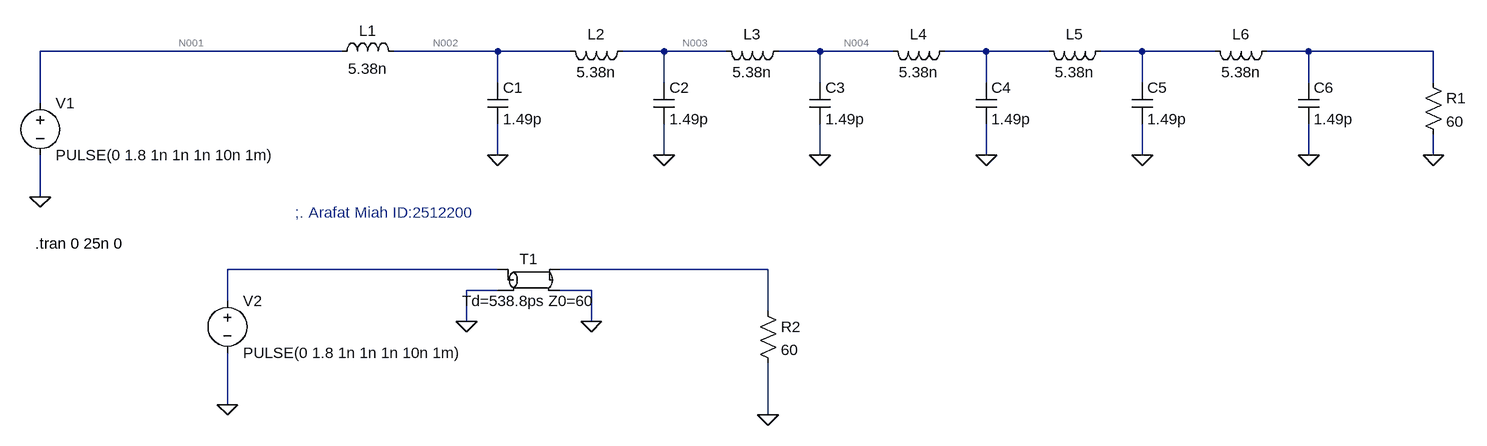
[diagram p0: schematic Draft1.asc]
Draft1.asc, the LTspice schematic file:
Version 4
SHEET 1 2136 680
WIRE 352 64 -112 64
WIRE 592 64 432 64
WIRE 704 64 592 64
WIRE 848 64 784 64
WIRE 944 64 848 64
WIRE 1088 64 1024 64
WIRE 1200 64 1088 64
WIRE 1344 64 1280 64
WIRE 1440 64 1344 64
WIRE 1584 64 1520 64
WIRE 1696 64 1584 64
WIRE 1840 64 1776 64
WIRE 2032 64 1840 64
WIRE 592 112 592 64
WIRE 848 112 848 64
WIRE 1088 112 1088 64
WIRE 1344 112 1344 64
WIRE 1584 112 1584 64
WIRE 1840 112 1840 64
WIRE 2032 112 2032 64
WIRE -112 144 -112 64
WIRE 592 224 592 176
WIRE 848 224 848 176
WIRE 1088 224 1088 176
WIRE 1344 224 1344 176
WIRE 1584 224 1584 176
WIRE 1840 224 1840 176
WIRE 2032 224 2032 192
WIRE -112 288 -112 224
WIRE 592 400 176 400
WIRE 1008 400 688 400
WIRE 592 432 544 432
WIRE 736 432 688 432
WIRE 176 448 176 400
WIRE 1008 464 1008 400
WIRE 544 480 544 432
WIRE 736 480 736 432
WIRE 176 608 176 528
WIRE 1008 624 1008 544
FLAG -112 288 0
FLAG 592 224 0
FLAG 848 224 0
FLAG 1088 224 0
FLAG 1344 224 0
FLAG 1584 224 0
FLAG 1840 224 0
FLAG 2032 224 0
FLAG 544 480 0
FLAG 736 480 0
FLAG 176 608 0
FLAG 1008 624 0
SYMBOL voltage -112 128 R0
WINDOW 123 0 0 Left 0
WINDOW 39 0 0 Left 0
SYMATTR InstName V1
SYMATTR Value PULSE(0 1.8 1n 1n 1n 10n 1m)
SYMBOL res 2016 96 R0
SYMATTR InstName R1
SYMATTR Value 60
SYMBOL ind 336 80 R270
WINDOW 0 32 56 VTop 2
WINDOW 3 5 56 VBottom 2
SYMATTR InstName L1
SYMATTR Value 5.38n
SYMBOL cap 576 112 R0
SYMATTR InstName C1
SYMATTR Value 1.49p
SYMBOL ind 800 48 R90
WINDOW 0 5 56 VBottom 2
WINDOW 3 32 56 VTop 2
SYMATTR InstName L2
SYMATTR Value 5.38n
SYMBOL cap 832 112 R0
SYMATTR InstName C2
SYMATTR Value 1.49p
SYMBOL ind 1040 48 R90
WINDOW 0 5 56 VBottom 2
WINDOW 3 32 56 VTop 2
SYMATTR InstName L3
SYMATTR Value 5.38n
SYMBOL cap 1072 112 R0
SYMATTR InstName C3
SYMATTR Value 1.49p
SYMBOL ind 1296 48 R90
WINDOW 0 5 56 VBottom 2
WINDOW 3 32 56 VTop 2
SYMATTR InstName L4
SYMATTR Value 5.38n
SYMBOL cap 1328 112 R0
SYMATTR InstName C4
SYMATTR Value 1.49p
SYMBOL ind 1536 48 R90
WINDOW 0 5 56 VBottom 2
WINDOW 3 32 56 VTop 2
SYMATTR InstName L5
SYMATTR Value 5.38n
SYMBOL cap 1568 112 R0
SYMATTR InstName C5
SYMATTR Value 1.49p
SYMBOL ind 1792 48 R90
WINDOW 0 5 56 VBottom 2
WINDOW 3 32 56 VTop 2
SYMATTR InstName L6
SYMATTR Value 5.38n
SYMBOL cap 1824 112 R0
SYMATTR InstName C6
SYMATTR Value 1.49p
SYMBOL voltage 176 432 R0
WINDOW 123 0 0 Left 0
WINDOW 39 0 0 Left 0
SYMATTR InstName V2
SYMATTR Value PULSE(0 1.8 1n 1n 1n 10n 1m)
SYMBOL tline 640 416 R0
SYMATTR InstName T1
SYMATTR Value Td=538.8ps Z0=60
SYMBOL res 992 448 R0
SYMATTR InstName R2
SYMATTR Value 60
TEXT -120 360 Left 2 !.tran 0 25n 0
TEXT 280 312 Left 2 ;;. Arafat Miah ID:2512200

The netlist it stands for:
* Draft1.asc
V1 N001 0 PULSE(0 1.8 1n 1n 1n 10n 1m)
R1 N007 0 60
L1 N001 N002 5.38n
C1 N002 0 1.49p
L2 N003 N002 5.38n
C2 N003 0 1.49p
L3 N004 N003 5.38n
C3 N004 0 1.49p
L4 N005 N004 5.38n
C4 N005 0 1.49p
L5 N006 N005 5.38n
C5 N006 0 1.49p
L6 N007 N006 5.38n
C6 N007 0 1.49p
V2 N008 0 PULSE(0 1.8 1n 1n 1n 10n 1m)
T1 N008 0 N009 0 Td=538.8ps Z0=60
R2 N009 0 60
.tran 0 25n 0
* ;. Arafat Miah ID:2512200
.backanno
.end

* Results of the author's LTspice run, read from the files saved beside the schematic
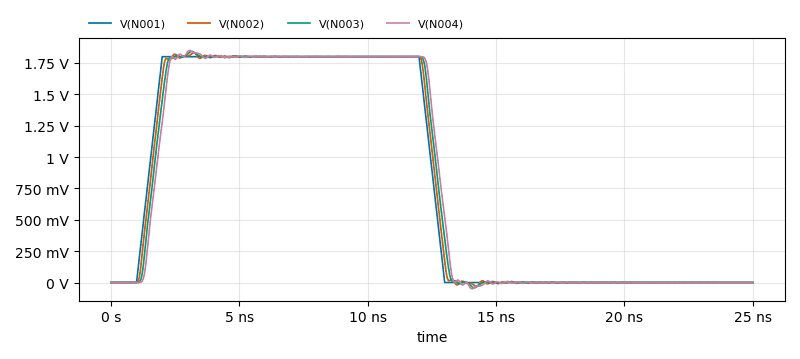
[diagram p1: Transient Analysis of Draft1.asc, plotted from the saved traces]
* Transient Analysis, 1 run:
*   V(N001): min 0 V, max 1.8 V, average 792 mV, rms 1.176 V, last 0 V
*   V(N002): min -31.28 mV, max 1.831 V, average 792 mV, rms 1.176 V, last 69.14 µV
*   V(N003): min -42.4 mV, max 1.842 V, average 792 mV, rms 1.176 V, last -87.57 µV
*   V(N004): min -50.14 mV, max 1.85 V, average 792 mV, rms 1.176 V, last 68.52 µV